# EAGLE design McPiFace-60mmFan-V3 (EAGLE 7.4.0)
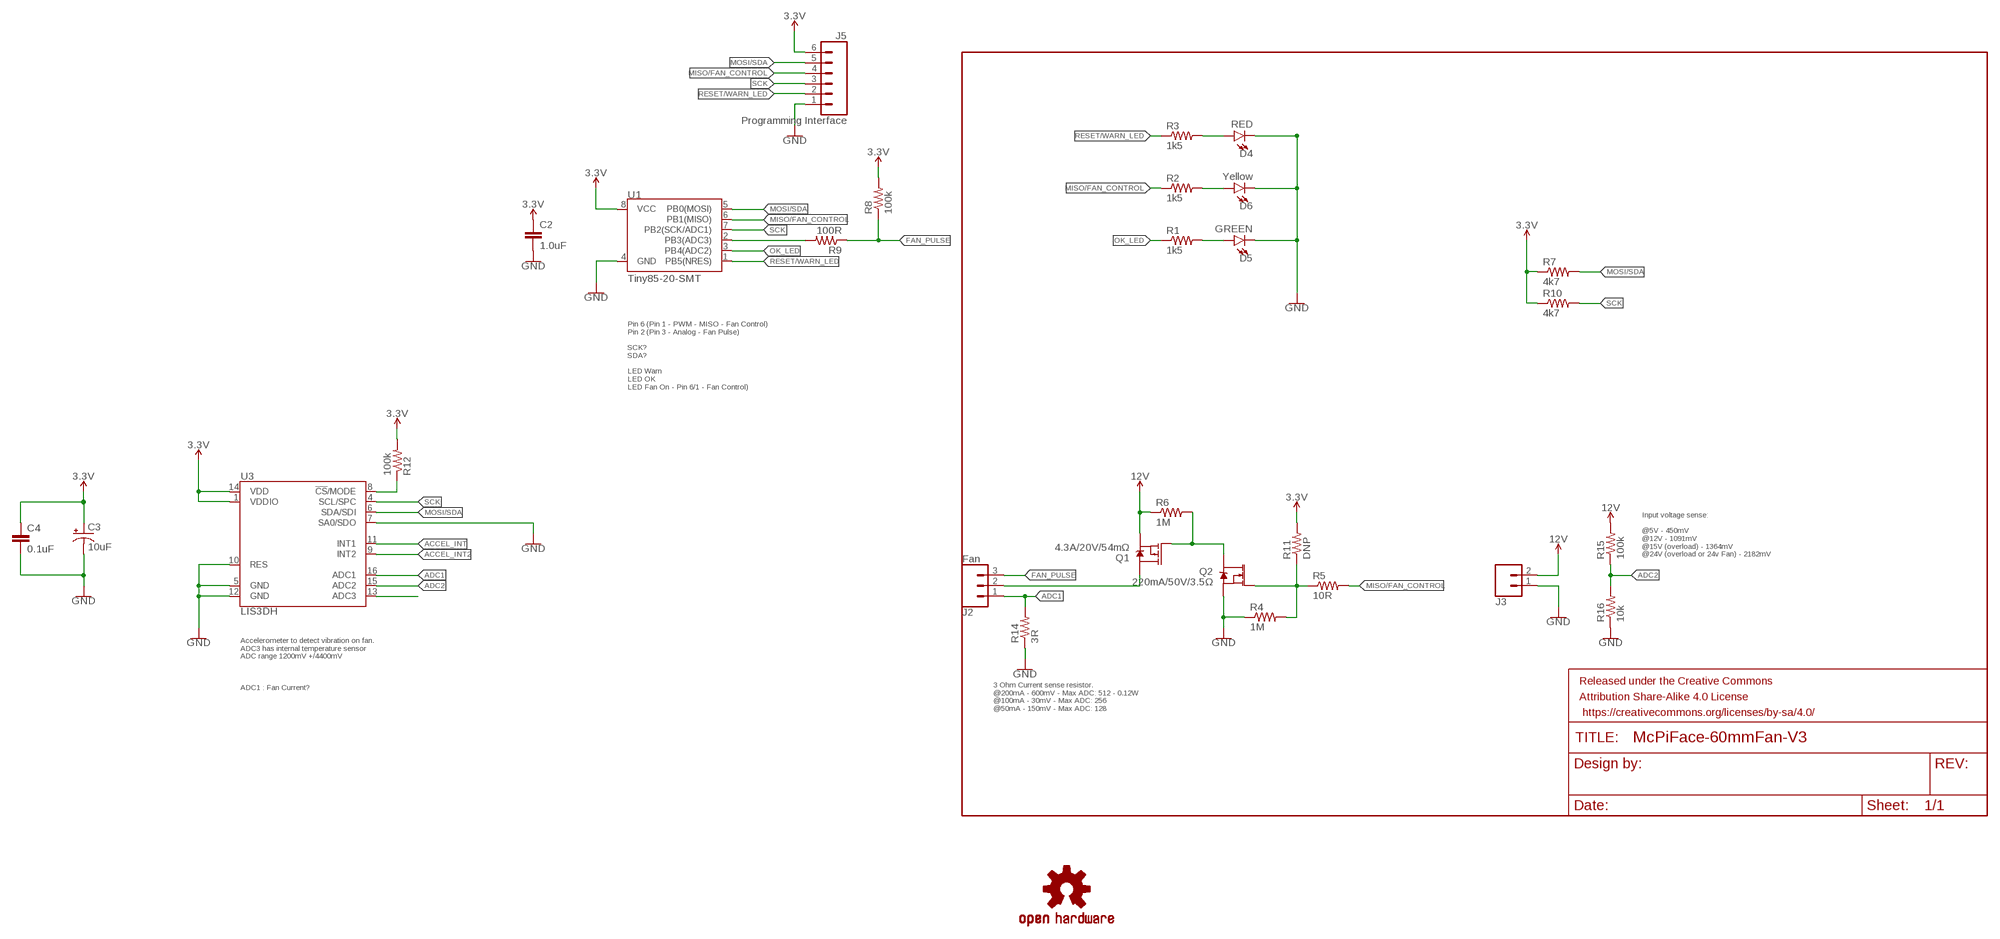
[diagram p0: schematic, sheet 1]

## Parts
C2  1.0uF  1.0UF-0805-25V-10%  [0805]
C3  10uF  10UF-16V-10%(TANT)  [EIA3216]
C4  0.1uF  1.0UF-0805-25V-10%  [0805]
D4  RED  LED-RED1206  [LED-1206]
D5  GREEN  LED-GREEN1206  [LED-1206]
D6  Yellow  LED-YELLOWLILYPAD  [LED-1206]
FRAME1  FRAME-LETTER  [CREATIVE_COMMONS]
J2  Fan  CONN_03JST-SMD  [JST-3-SMD]
J3  CONN_02-JST-2MM-SMT  [JST-2-SMD]
J5  Programming Interface  CONN_06SMD-1MM  [1X06-1MM]
LOGO1  OSHW-LOGOL  [OSHW-LOGO-L]
Q1  4.3A/20V/54mΩ  MOSFET_PCH-IRLML2244  [SOT23-3]
Q2  220mA/50V/3.5Ω  MOSFET-NCH-BSS138  [SOT23-3]
R1  1k5  RESISTOR0805-RES  [0805]
R2  1k5  RESISTOR0805-RES  [0805]
R3  1k5  RESISTOR0805-RES  [0805]
R4  1M  RESISTOR0805-RES  [0805]
R5  10R  RESISTOR0805-RES  [0805]
R6  1M  RESISTOR0805-RES  [0805]
R7  4k7  RESISTOR0805-RES  [0805]
R8  100k  RESISTOR0805-RES  [0805]
R9  100R  RESISTOR0805-RES  [0805]
R10  4k7  RESISTOR0805-RES  [0805]
R11  DNP  RESISTOR0805-RES  [0805]
R12  100k  RESISTOR0805-RES  [0805]
R14  3R  RESISTOR0805-RES  [0805]
R15  100k  RESISTOR0805-RES  [0805]
R16  10k  RESISTOR0805-RES  [0805]
U1  Tiny85-20-SMT  ATTINY45TINY85-20-SMT  [SO08-EIAJ]
U3  LIS3DH  [LGA-16-3X3]

## Nets
3.3V: C2.1 C3.A(+) C4.1 J5.6 R7.1 R8.2 R10.1 R11.2 R12.2 U1.8(VCC) U3.1(VDDIO) U3.14(VDD)
12V: J3.2 Q1.2(S) R6.1 R15.2
ACCEL_INT: U3.11(INT1)
ACCEL_INT2: U3.9(INT2)
ADC1: J2.1 R14.2 U3.16(ADC1)
ADC2: R15.1 R16.2 U3.15(ADC2)
FAN_PULSE: J2.3 R8.1 R9.1
GND: C2.2 C3.C(-) C4.2 D4.C D5.C D6.C J3.1 J5.1 Q2.2(S) R4.1 R14.1 R16.1 U1.4(GND) U3.5(GND) U3.7(SA0/SDO) U3.10(RES) U3.12(GND)
MISO/FAN_CONTROL: J5.4 R2.1 R5.2 U1.6(PB1(MISO))
MOSI/SDA: J5.5 R7.2 U1.5(PB0(MOSI)) U3.6(SDA/SDI)
N$1: R9.2 U1.2(PB3(ADC3))
N$2: D4.A R3.2
N$3: D6.A R2.2
N$4: D5.A R1.2
N$5: U3.13(ADC3)
N$7: R12.1 U3.8(!CS!/MODE)
N$8: J2.2 Q1.3(D)
N$10: Q1.1(G) Q2.3(D) R6.2
N$11: Q2.1(G) R4.2 R5.1 R11.1
OK_LED: R1.1 U1.3(PB4(ADC2))
RESET/WARN_LED: J5.2 R3.1 U1.1(PB5(NRES))
SCK: J5.3 R10.2 U1.7(PB2(SCK/ADC1)) U3.4(SCL/SPC)

## Notes on the sheet
- Pin 6 (Pin 1 - PWM - MISO - Fan Control)
  Pin 2 (Pin 3 - Analog - Fan Pulse)
  
  SCK?
  SDA?
  
  LED Warn
  LED OK
  LED Fan On - Pin 6/1 - Fan Control)
- Input voltage sense:
  
  @5V - 450mV
  @12V - 1091mV
  @15V (overload) - 1364mV
  @24V (overload or 24v Fan) - 2182mV
- Accelerometer to detect vibration on fan.
  ADC3 has internal temperature sensor
  ADC range 1200mV +/4400mV
- ADC1 : Fan Current?
- 3 Ohm Current sense resistor.
  @200mA - 600mV - Max ADC: 512 - 0.12W
  @100mA - 30mV - Max ADC: 256
  @50mA - 150mV - Max ADC: 128

## Library data of the parts
C2 = SparkFun-Capacitors:1.0UF: 1µF ceramic capacitors A capacitor is a passive two-terminal electrical component used to store electrical energy temporarily in an electric field.; PROD_ID: CAP-08064
C3 = SparkFun-Capacitors:10UF-16V-10%(TANT): CAP-00811 1206/EIA-3216 Tantalum capacitor; PROD_ID: CAP-00811
C4 = SparkFun-Capacitors:1.0UF: 1µF ceramic capacitors A capacitor is a passive two-terminal electrical component used to store electrical energy temporarily in an electric field.; PROD_ID: CAP-08064; VALUE: 1.0uF
D4 = SparkFun-LED:LED-RED: Red SMD LED Used in manufacturing of most products at SparkFun Packages: 0603 - SMD 0603 package [Product Link] <http://docs.avagotech.com/docs/AV02-0551EN> 0603 SMART - SMD 0603 SMART package ( more efficient and expensive)[Product Link] <http://www.osram-os.com/Graphics/XPic2/00077099_0.pdf> 1206 - SMD1206 package [Product Link] <https://www.sparkfun.com/datasheets/DevTools/LilyPad/Q150OVS4.pdff> SparkFun Products: Pro Mini 328 -5V <https://www.sparkfun.com/products/821> RedBoard <https://www.sparkfun.com/products/12757> IOIO-OTG <https://www.sparkfun.com/products/13613>; PROD_ID: DIO-09912
D5 = SparkFun-LED:LED-GREEN: Green SMD LED Used in manufacturing of various products at SparkFun Packages: 0603 - SMD 0603 package [Product Link] <http://www.futureelectronics.com/en/technologies/semiconductors/optoelectronics/leds/Pages/9894312-LTST-C190GKT.aspx?CrossPart=HSMG-C190&IM=0> LilyPad 1206 - SMD1206 LilyPad package [Product Link] <http://www.futureelectronics.com/en/Technologies/Product.aspx?ProductID=IN150NGHARVATEKCORPORATION2049943&IM=0> 1206 - SMD1206 package [Product Link] <http://www.futureelectronics.com/en/technologies/semiconductors/optoelectronics/leds/Pages/8315665-LTST-C150KGKT.aspx?IM=0> 1206 Bottom Mount -SMD 1206 Bottom Mount [Product Link] <http://www.digikey.com/product-detail/en/lite-on-inc/LTST-C230KGKT/160-1456-1-ND/386854> SparkFun Products: Pro Mini 328 -5V <https://www.sparkfun.com/products/821> RedBoard <https://www.sparkfun.com/products/12757> MP3 Trigger <https://www.sparkfun.com/products/13720> Makey Makey <https://www.sparkfun.com/products/11076>; PROD_ID: DIO-00862
D6 = SparkFun-LED:LED-YELLOW: Yellow SMD LED Used in manufacturing several products at SparkFun. Packages: 0603 - SMD 0603 package[Product Link] <http://www.kingbrightusa.com/product.asp?catalog_name=LED&product_id=APT1608SYCK> 0603 -SMART - SMART SMD 0603 package (more efficient/more expensive) [Product Link] <http://www.osram-os.com/osram_os/en/products/product-catalog/led-light-emitting-diodes/smartled-0603/ly-l29k/index.jsp> LilyPad - SMD1206 package[Product Datasheet] <https://www.sparkfun.com/datasheets/DevTools/LilyPad/Q150YUS4.pdf> SparkFun Products: Blynk Board <https://www.sparkfun.com/products/13794> IOIO-OTG <https://www.sparkfun.com/products/13613> XBee Explorer Serial <https://www.sparkfun.com/products/13225>; PROD_ID: DIO-09909
FRAME1 = SparkFun-Aesthetics:FRAME-LETTER: Schematic Frame Standard 8.5x11 US Letter frame
J2 = SparkFun-Connectors:CONN_03: Multi connection point. Often used as Generic Header-pin footprint for 0.1 inch spaced/style header connections On any of the 0.1 inch spaced packages, you can populate with these: Break Away Headers - Straight <https://www.sparkfun.com/products/116> (PRT-00116) Break Away Male Headers - Right Angle <https://www.sparkfun.com/products/553> (PRT-00553) Female Headers <https://www.sparkfun.com/products/115> (PRT-00115) Break Away Headers - Machine Pin <https://www.sparkfun.com/products/117> (PRT-00117) Break Away Female Headers - Swiss Machine Pin <https://www.sparkfun.com/products/743> (PRT-00743) Stackable Header - 3 Pin (Female, 0.1") <https://www.sparkfun.com/products/13875> (PRT-13875) For SCREWTERMINALS and SPRING TERMINALS visit here: Screw Terimnals on SparkFun.com <https://www.sparkfun.com/search/results?term=Screw+Terminals> (5mm/3.5mm/2.54mm spacing) This device is also useful as a general connection point to wire up your design to another part of your project. Our various solder wires solder well into these plated through hole pads. Hook-Up Wire - Assortment (Stranded, 22 AWG) <https://www.sparkfun.com/products/11375> (PRT-11375) Hook-Up Wire - Assortment (Solid Core, 22 AWG) <https://www.sparkfun.com/products/11367> (PRT-11367) View the entire wire category on our website here <https://www.sparkfun.com/categories/141> Special notes: Molex polarized connector foot print use with SKU : PRT-08232 with associated crimp pins and housings.; FARNELL: 9492623; MFG: S3B-PH-SM4-TB(LF)(SN); PROD_ID: CONN-12591; VALUE: 3-PIN SMD
J3 = SparkFun-Connectors:CONN_02: Multi connection point. Often used as Generic Header-pin footprint for 0.1 inch spaced/style header connections On any of the 0.1 inch spaced packages, you can populate with these: Break Away Headers - Straight <https://www.sparkfun.com/products/116> (PRT-00116) Break Away Male Headers - Right Angle <https://www.sparkfun.com/products/553> (PRT-00553) Female Headers <https://www.sparkfun.com/products/115> (PRT-00115) Break Away Headers - Machine Pin <https://www.sparkfun.com/products/117> (PRT-00117) Break Away Female Headers - Swiss Machine Pin <https://www.sparkfun.com/products/743> (PRT-00743) For SCREWTERMINALS and SPRING TERMINALS visit here: Screw Terimnals on SparkFun.com <https://www.sparkfun.com/search/results?term=Screw+Terminals> (5mm/3.5mm/2.54mm spacing) This device is also useful as a general connection point to wire up your design to another part of your project. Our various solder wires solder well into these plated through hole pads. Hook-Up Wire - Assortment (Stranded, 22 AWG) <https://www.sparkfun.com/products/11375> (PRT-11375) Hook-Up Wire - Assortment (Solid Core, 22 AWG) <https://www.sparkfun.com/products/11367> (PRT-11367) View the entire wire category on our website here <https://www.sparkfun.com/categories/141> Special notes: Molex polarized connector foot print use with: PRT-08233 with associated crimp pins and housings. 2.54_SCREWTERM for use with PRT-10571. 3.5mm Screw Terminal footprints for PRT-08084 5mm Screw Terminal footprints for use with PRT-08432; FARNELL: 9492615; MFG: S2B-PH-SM4-TB(LF)(SN); PROD_ID: CONN-11443
J5 = SparkFun-Connectors:CONN_06: Multi connection point. Often used as Generic Header-pin footprint for 0.1 inch spaced/style header connections On any of the 0.1 inch spaced packages, you can populate with these: Break Away Headers - Straight <https://www.sparkfun.com/products/116> (PRT-00116) Break Away Male Headers - Right Angle <https://www.sparkfun.com/products/553> (PRT-00553) Female Headers <https://www.sparkfun.com/products/115> (PRT-00115) Break Away Headers - Machine Pin <https://www.sparkfun.com/products/117> (PRT-00117) Break Away Female Headers - Swiss Machine Pin <https://www.sparkfun.com/products/743> (PRT-00743) Arduino Stackable Header - 6 Pin <https://www.sparkfun.com/products/9280> (PRT-09280) For SCREWTERMINALS and SPRING TERMINALS visit here: Screw Terimnals on SparkFun.com <https://www.sparkfun.com/search/results?term=Screw+Terminals> (5mm/3.5mm/2.54mm spacing) This device is also useful as a general connection point to wire up your design to another part of your project. Our various solder wires solder well into these plated through hole pads. Hook-Up Wire - Assortment (Stranded, 22 AWG) <https://www.sparkfun.com/products/11375> (PRT-11375) Hook-Up Wire - Assortment (Solid Core, 22 AWG) <https://www.sparkfun.com/products/11367> (PRT-11367) View the entire wire category on our website here <https://www.sparkfun.com/categories/141>; PROD_ID: CONN-08249; SF_ID: GPS-00579
LOGO1 = SparkFun-Aesthetics:OSHW-LOGO: Open-Source Hardware (OSHW) Logo This logo indicates the piece of hardware it is found on incorporates a OSHW license and/or adheres to the definition of open source hardware found here: http://freedomdefined.org/OSHW
Q1 = SparkFun-DiscreteSemi:MOSFET_PCH: P-channel MOSFETs Voltage controlled devices that allow control of high current outputs. SparkFun Products: SparkFun ESP32 Thing <https://www.sparkfun.com/products/13907> SparkFun ESP8266 Thing <https://www.sparkfun.com/products/13231>; PROD_ID: TRANS-11153
Q2 = SparkFun-DiscreteSemi:MOSFET-NCH: N-channel MOSFETs Voltage controlled devices that allow control of high current outputs. SparkFun Products: SparkFun OpenScale <https://www.sparkfun.com/products/13261> SparkFun Digital Sandbox <https://www.sparkfun.com/products/12651> SparkFun Monster Moto Shield <https://www.sparkfun.com/products/10182> SparkFun MOSFET Power Controller <https://www.sparkfun.com/products/11214>; PROD_ID: TRANS-00830
R1-R12 R14-R16 = SparkFun-Resistors:RESISTOR: Resistor Basic schematic elements and footprints for 0603, 1206, and PTH resistors.
U1 = SparkFun-DigitalIC:ATTINY45: Atmel 8-pin 2/4/8kB flash uC; PROD_ID: IC-09092
U3 = SparkFun-Sensors:LIS3DH: ST Microelectronics LIS3DH 3-Axis ±2/4/8/16g SPI/I2C Accelerometer The LIS3DH is a three axis MEMS linear accelerometer in the "nano" family. It has a digital I2C/SPI serial interface which makes it ideal for using in embedded applications. The device also features ultra low-power operational modes that allow advanced power saving and smart sleep to wake-up functions, built in detections with interrupts, and auxiliary ADC inputs Datasheet-XXXX <http://www.sparkfun.com/datasheets/Sensors/Accelerometer/LIS3DH.pdf> SparkFun Products SparkFun Triple Axis Accelerometer Breakout - LIS3DH <https://www.sparkfun.com/products/10345> (SEN-XXXXX) Triple Axis Accelerometer - LIS3DH <https://www.sparkfun.com/products/9755> (SEN-XXXXX); PROD_ID: IC-13419; SF_ID: N/A

## Board
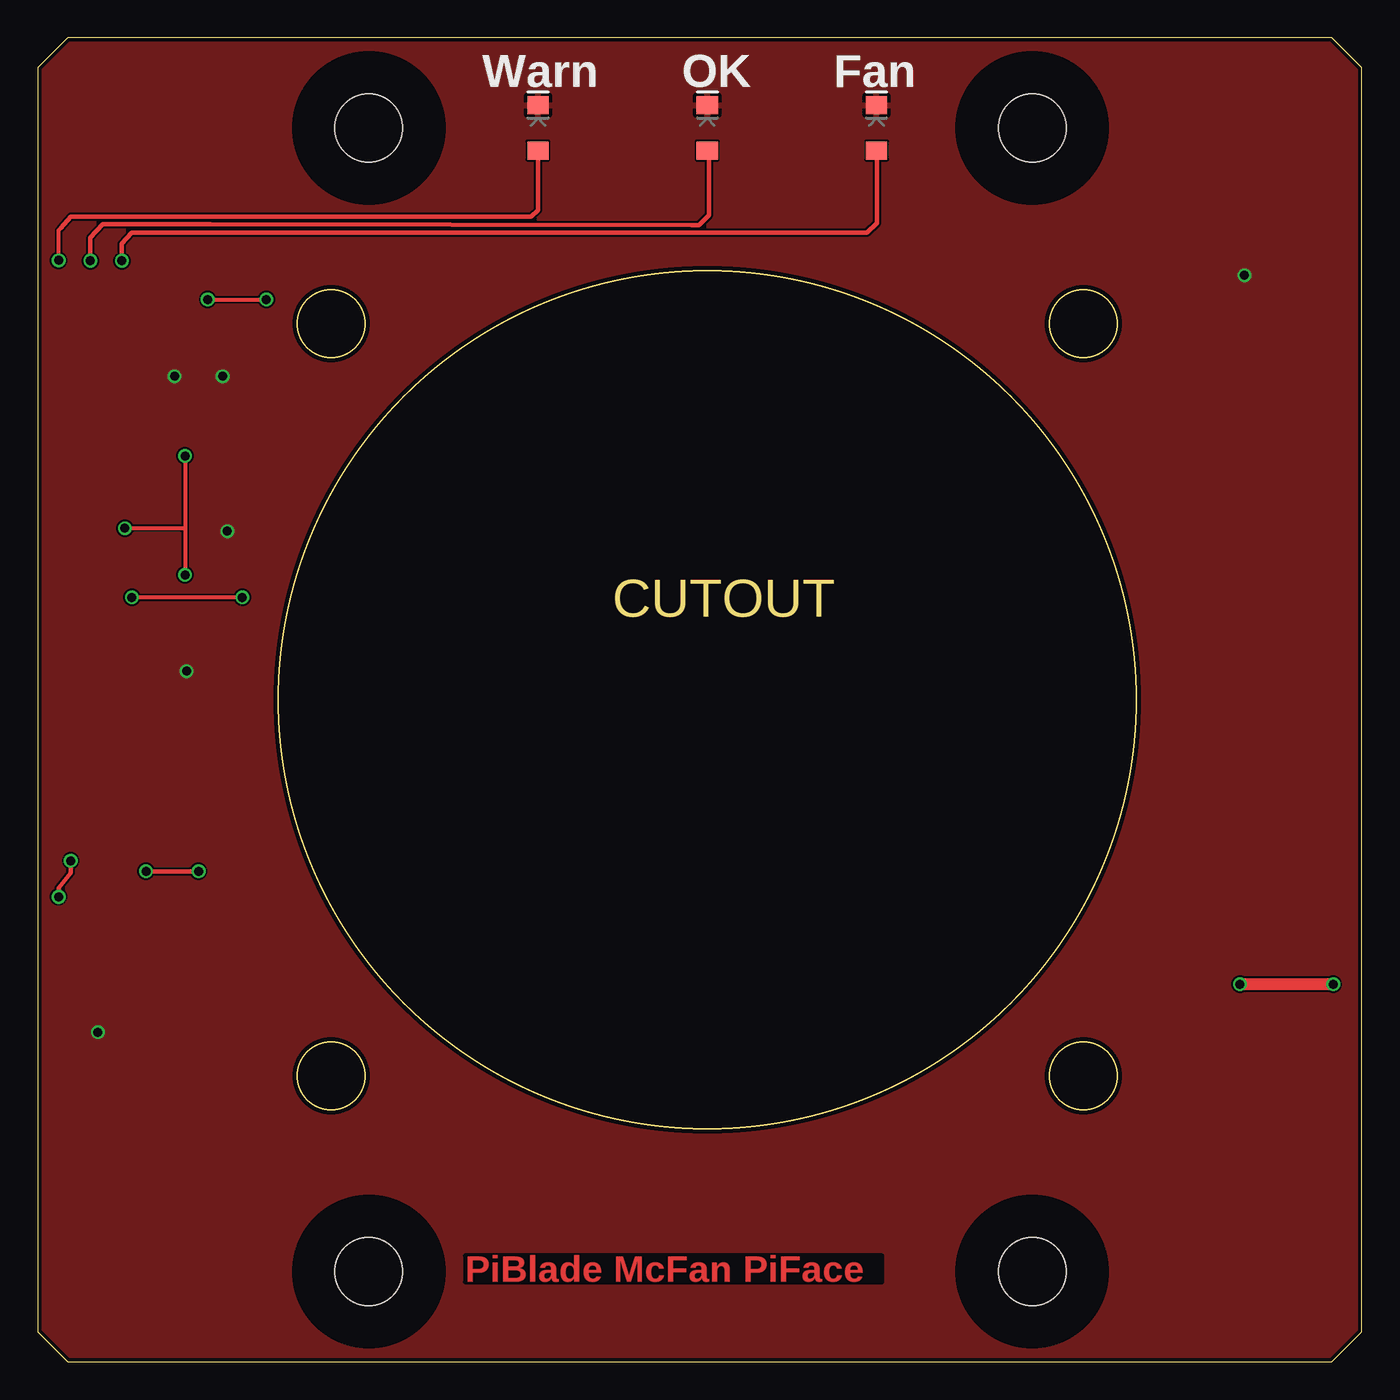
[diagram p1: board, top side]
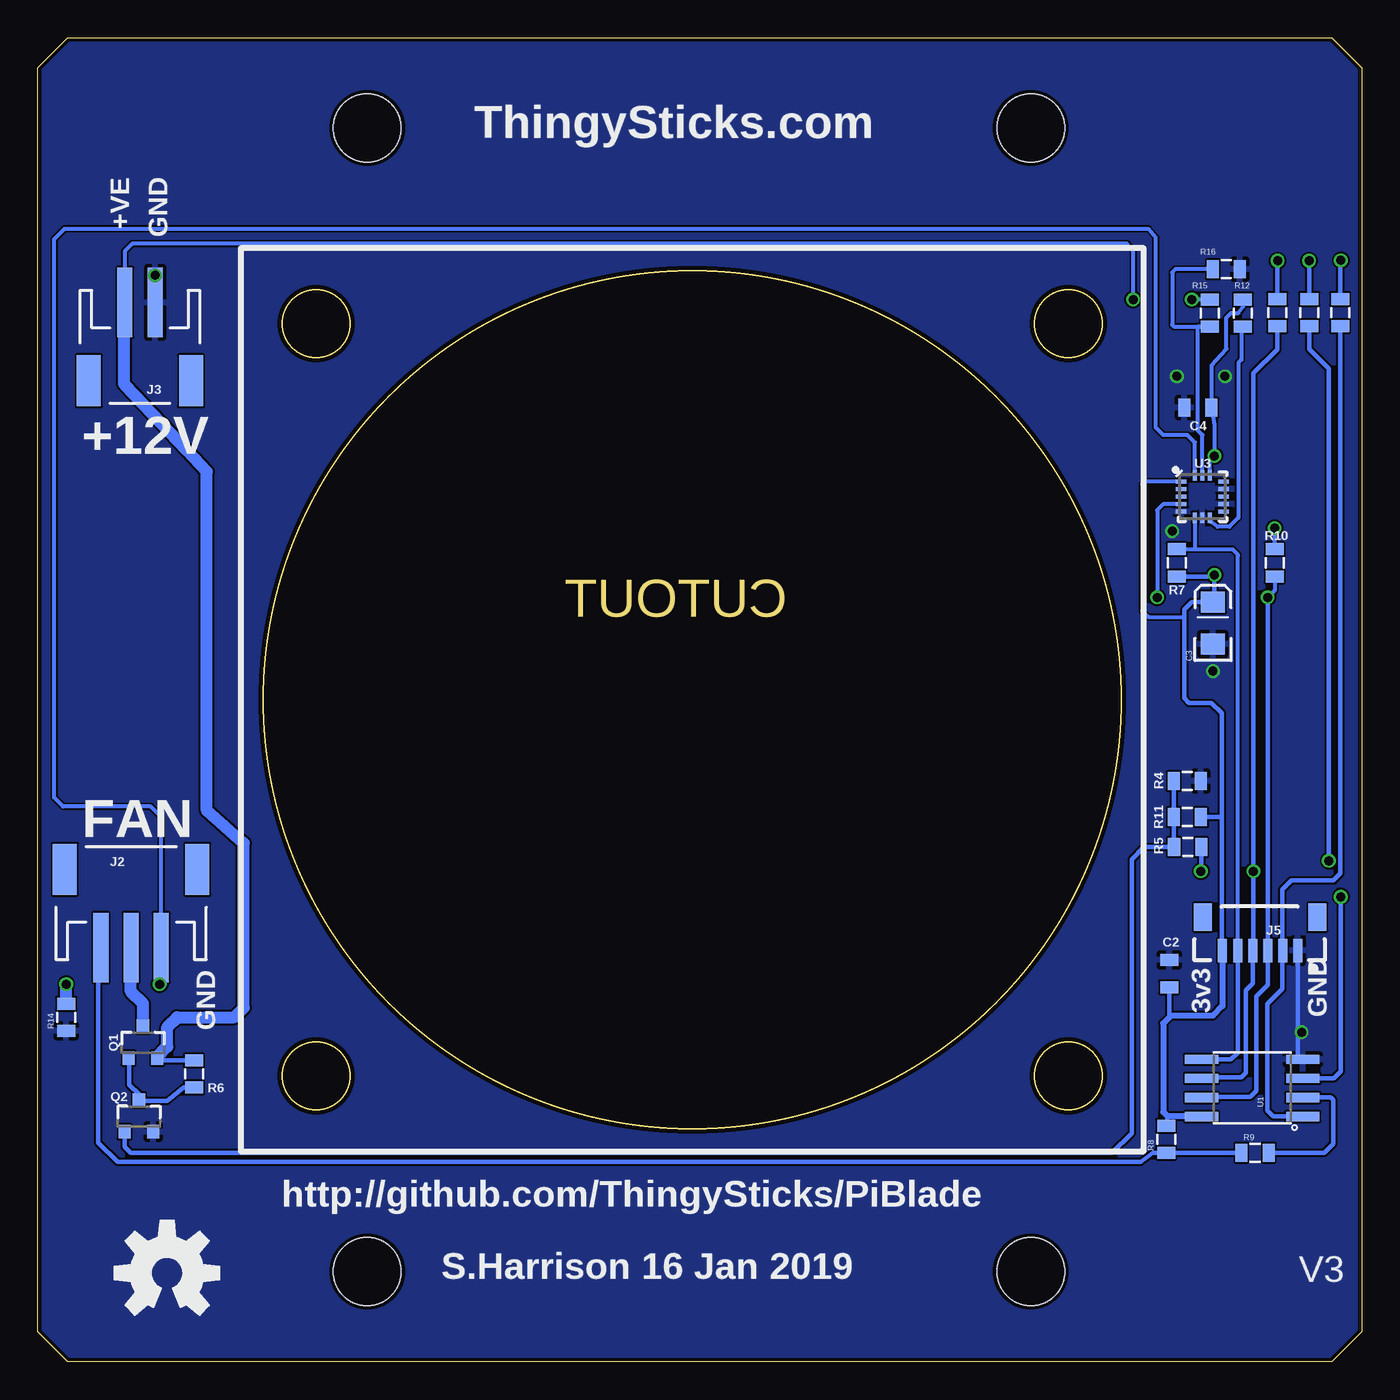
[diagram p2: board, bottom side, seen from below]

Size 88 x 88 mm. Coordinates in mm from the lower left corner, seen from the top.
Outline: 2,0 86,0 88,2 88,86 86,88 2,88 0,86 0,2 2,0
Outline: circle at 44.5,44 radius 28.5
Outline: circle at 19.5,69 radius 2.25
Outline: circle at 69.5,69 radius 2.25
Outline: circle at 69.5,19 radius 2.25
Outline: circle at 19.5,19 radius 2.25
Copper layers (1*16): Top 0.035mm / dielectric 1.5mm / Bottom 0.035mm
Design rules "dirt_cheap_dirty_boards.v1": minimum track width 5mil, minimum drill 12mil, track to track 5mil, track to pad 5mil, pad to pad 5mil, via to via 5mil, smd to smd 0mil, copper to edge 10mil, drill to drill 10mil, minimum pad ring 10mil, minimum via ring 6mil, stop-mask expansion 2mil, vias tented up to drill 25mil, thermal gap 10mil
Holes 4.5 mm at 22,6 22,82 66.1,82 66.1,6
tRestrict: area 17,77 to 27,87; area 17,1 to 27,11; area 61.1,1 to 71.1,11; area 61.1,77 to 71.1,87

### Footprints (pad centres in the part's own frame; a part is rotated, then mirrored left to right if it is on the bottom)
0805 = smd 0.8 x 1.2: 1 -0.9,0; 2 0.9,0
EIA3216 = smd 1.4 x 1.6: A 1.4,0; C -1.4,0
LED-1206 = smd 1.2 x 1.4: A -1.5,0; C 1.5,0
JST-3-SMD = smd 1 x 4.6: 1 2.01,-4.77; 2 0.01,-4.77; 3 -1.99,-4.77 | smd 1.6 x 3.4: NC1 -4.39,0.43; NC2 4.41,0.43
JST-2-SMD = smd 1 x 4.6: 1 -1,-3.7; 2 1,-3.7 | smd 1.6 x 3.4: NC1 -3.4,1.5; NC2 3.4,1.5
1X06-1MM = smd 0.6 x 1.55: 1 -2.54,1.27; 2 -1.54,1.27; 3 -0.54,1.27; 4 0.46,1.27; 5 1.46,1.27; 6 2.46,1.27 | smd 1.2 x 1.8: P$1 -3.84,-0.955; P$2 3.76,-0.955
SOT23-3 = smd 0.8 x 0.9: 1 -0.95,-1; 2 0.95,-1; 3 0,1.1
SO08-EIAJ = smd 0.61 x 2.21: 1 -1.905,-3.378; 2 -0.635,-3.378; 3 0.635,-3.378; 4 1.905,-3.378; 5 1.905,3.353; 6 0.635,3.353; 7 -0.635,3.353; 8 -1.905,3.353
LGA-16-3X3 = smd 0.7 x 0.28: 1 -1.4,1; 2 -1.4,0.5; 3 -1.4,0; 4 -1.4,-0.5; 5 -1.4,-1; 9 1.4,-1; 10 1.4,-0.5; 11 1.4,0; 12 1.4,0.5; 13 1.4,1 | smd 0.28 x 0.7: 6 -0.5,-1.4; 7 0,-1.4; 8 0.5,-1.4; 14 0.5,1.4; 15 0,1.4; 16 -0.5,1.4

### Placement (x,y rotation side)
C2  12.8,25.8 90 bottom
C3  9.9,49.1 90 bottom
C4  10.9,63.4 180 bottom
D4  33.25,82 90 top
D5  44.5,82 90 top
D6  55.75,82 90 top
FRAME1  6.2,-14.8 0 top  (outside the outline)
J2  81.8,32.3 0 bottom
J3  81.2,66.7 180 bottom
J5  6.8,28.6 180 bottom
LOGO1  79.4,5.9 0 bottom
Q1  81,21.2 0 bottom
Q2  81.27,16.3 0 bottom
R1  3.5,69.73 90 bottom
R2  5.62,69.73 90 bottom
R3  1.45,69.73 90 bottom
R4  11.6,38.59 180 bottom
R5  11.58,34.2 0 bottom
R6  77.6,19.13 270 bottom
R7  12.3,53.1 90 bottom
R8  13,14.8 90 bottom
R9  7.1,13.9 0 bottom
R10  5.8,53.1 270 bottom
R11  11.6,36.2 0 bottom
R12  7.9,69.7 90 bottom
R14  86.1,22.9 90 bottom
R15  10.1,69.7 90 bottom
R16  9,72.6 180 bottom
U1  7.3,18.2 90 bottom
U3  10.6,57.5 0 bottom

### Tracks (layer width: path | path; a pad name or v marks a point on that pad's centre or on a via)
3.3V  (via drill 0.6)
  Top 0.254: v9.8,60.2 9.8,55.4 | 9.8,55.4 v9.8,52.3 | v5.8,55.4 9.8,55.4
  Bottom 0.254: U3.14 10.1,59.9 v9.8,60.2 9.8,62.3 C4.1 10,66.2 9,67.3 9,69.4 8.7,69.7 8.2,69.7 7.9,70.1 R12.2 | 9.8,50.6 C3.A 10.5,49.9 | R10.1 v5.8,55.4 | U3.1 14.4,58.5 14.6,58.3 14.6,49.9 14.2,49.5 11.8,49.5 | 9.9,52.2 v9.8,52.3
  Bottom 0.305: R8.2 12.9,16.3 | U1.8 | C2.1 12.8,23.1 12.7,23 | J5.6 9.3,27.37 9.32,32 9.32,32.01 9.32,36.2 | R11.2 9.42,36.2 9.32,36.2 | v9.8,52.3 9.8,50.6 | C3.A 11.3,50.5 11.8,50 11.8,49.5 11.8,44.1 11.5,43.8 10,43.8 9.32,43.12 9.32,36.2 | R7.1 9.9,52.2
  Bottom 0.406: J5.6 9.26,23.64 9.9,23 12.7,23 13.2,22.5 13.2,16.6 12.9,16.3 U1.8
12V  (via drill 0.6)
  Top 0.254: v11.3,70.6 v15.2,70.6
  Bottom 0.254: v15.2,70.6 15.2,73.8 15.6,74.3 81.7,74.3 82.2,73.8 J3.2 | R15.2 v11.3,70.6
  Bottom 0.305: R6.1 79.88,20.03 Q1.2
  Bottom 0.813: Q1.2 80.05,20.28 79.38,20.95 79.38,22.26 78.74,22.89 74.93,22.89 74.3,23.53 74.3,34.46 76.77,36.63 76.77,59.16 78.03,60.52 82.18,64.92 82.25,65 82.25,70.75 J3.2
ADC1  (via drill 0.6)
  Top 0.813: v86.1,25.1 v79.9,25.1
  Bottom 0.254: J2.1 79.8,36.2 80.5,36.9 86.3,36.9 86.9,37.5 86.9,74.6 86.2,75.3 14.2,75.3 13.7,74.7 13.7,62.1 13.2,61.6 11.6,61.6 11.1,61.1 U3.16
  Bottom 0.305: J2.1
  Bottom 0.813: R14.2 v86.1,25.1 | v79.9,25.1 79.79,25.1 J2.1
ADC2
  Bottom 0.254: U3.15 10.6,61.6 10.9,61.9 10.9,68.8 12.5,68.8 12.6,68.9 12.6,72.4 12.4,72.6 R16.2
  Bottom 0.305: R15.1 10.9,68.8
FAN_PULSE
  Bottom 0.305: 83.69,27.43 J2.3 83.96,27.36 83.96,14.56 82.69,13.29 14.7,13.3 13.9,13.89 R8.1 R9.1
GND  (via drill 0.6)
  Bottom 0.305: J5.1 4.26,20.44 U1.4
  other vias: 4,21.9 80.2,72.2 9.1,65.5 9.9,45.9 12.6,55.2 12.3,65.5
  pour Top: -1,88.5 88.7,88.5 88.7,-1 -1,-1
  pour Bottom: -1,88.5 88.7,88.5 88.7,-1 -1,-1
MISO/FAN_CONTROL  (via drill 0.6)
  Top 0.305: v10.7,32.6 v7.2,32.6
  Bottom 0.305: U1.6 10.59,18.9 8,18.9 7.7,19.2 7.7,24.7 7.26,25.14 J5.4 7.2,27.39 v7.2,32.6 7.2,65.7 5.62,67.28 R2.1 | R5.2 10.68,32.92 v10.7,32.6
MOSI/SDA
  Bottom 0.254: J5.5 8.26,53.5 8.26,53.66 8.6,54 11.1,54 | U3.6 11.1,54 | R7.2 11.1,54
  Bottom 0.305: J5.5 8.26,20.54 8.7,20.1 U1.5
N$1
  Bottom 0.305: U1.2 2.06,17.57 1.9,17.4 1.9,14.5 2.5,13.9 R9.2
N$2  (via drill 0.6)
  Top 0.254: v1.4,73.2 1.4,75.2 1.54,75.34
  Top 0.305: D4.A 33.24,79.94 33.25,76.7 33.25,76.55 32.8,76.1 2.2,76.1 1.54,75.34
  Bottom 0.305: R3.2 1.45,73.16 v1.4,73.2
N$3  (via drill 0.6)
  Top 0.305: v5.6,73.17 5.6,74.3 6.25,75.03 55.12,75.03 55.76,75.67 D6.A
  Bottom 0.305: R2.2 5.62,73.16 v5.6,73.17
N$4  (via drill 0.6)
  Top 0.305: v3.5,73.17 3.5,74.7 4.33,75.6 11.5,75.6 43.45,75.53 43.95,75.53 44.6,76.2 44.6,79.9 D5.A
  Bottom 0.305: R1.2 v3.5,73.17
N$7
  Bottom 0.254: R12.1 8,68.6 8,66.6 8.2,66.4 8.2,56.1 8.8,55.5 9.6,55.5 10,55.8 10.1,55.9 U3.8
N$8
  Bottom 0.813: Q1.3 81,23.8 81.8,24.6 J2.2
N$10
  Bottom 0.305: Q1.1 81.92,20.16 81.92,18.41 81.27,17.77 Q2.3 81.22,17.34 79.38,17.34 78.29,18.23 R6.2
N$11
  Bottom 0.305: Q2.1 82.2,14.98 82.2,14.3 81.8,13.9 16.6,13.9 15.3,15.2 15.3,33.4 14.49,34.2 R5.1 12.5,34.23 R11.1 R4.2
OK_LED  (via drill 0.6)
  Top 0.305: v2.2,33.3 2.2,32.5 1.4,31.5 v1.4,30.9
  Bottom 0.305: U1.3 1.86,18.84 1.4,19.3 v1.4,30.9 | R1.1 3.5,67.3 2.2,66 v2.2,33.3
RESET/WARN_LED
  Bottom 0.305: J5.2 5.3,27.29 5.3,24.8 6.3,23.8 6.3,16.7 5.9,16.3 U1.1 | 5.2,27.39 J5.2 | R3.1 1.45,32.45 1.9,32 4.7,32 5.3,31.4 5.3,27.37 J5.2
SCK  (via drill 0.6)
  Top 0.254: v13.6,50.8 v6.26,50.8
  Bottom 0.254: U3.4 13.2,57 13.6,56.6 v13.6,50.8 | R10.2 5.8,51.26 v6.26,50.8
  Bottom 0.305: U1.7 10.62,17.6 7.4,17.6 7,18 7,24.3 6.26,25.04 J5.3 v6.26,50.8

### Text on the board
Top: PiBlade McFan PiFace
Dimension: CUTOUT
tNames: Warn | OK | Fan
bNames: ThingySticks.com | GND | +VE | +12V | FAN | GND | GND | 3v3 | http://github.com/ThingySticks/PiBlade | S.Harrison 16 Jan 2019 | V3